# EAGLE schematic GY-SAMD21_HeaderLayout (EAGLE 9.6.2)
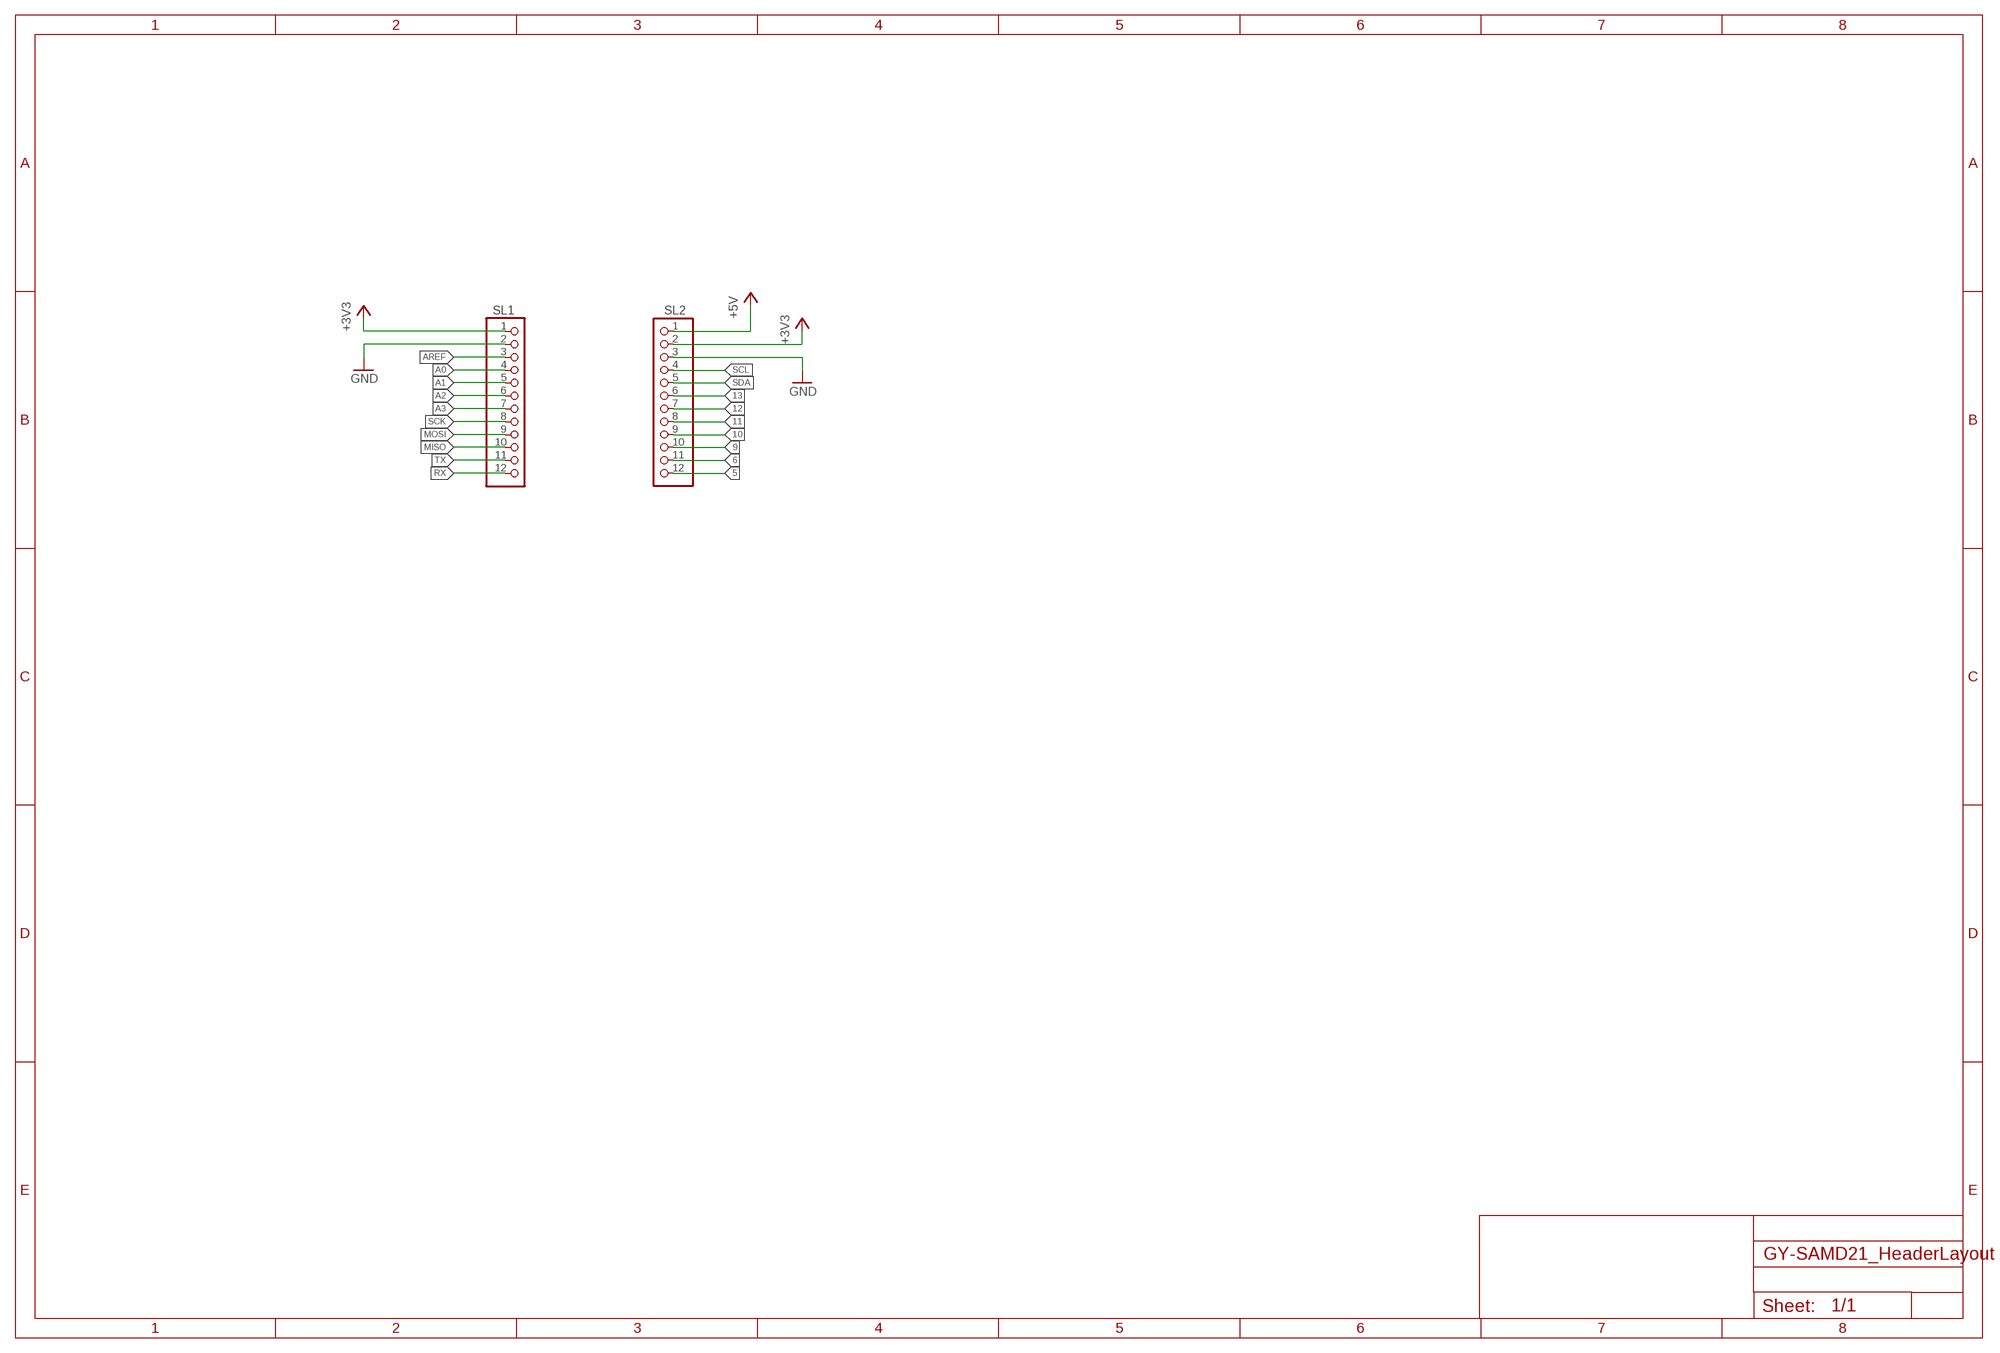
[diagram p0: schematic, sheet 1]

## Parts
SL1  PINHD-1X12  [1X12]
SL2  PINHD-1X12  [1X12]

## Nets
5: SL2.12
6: SL2.11
9: SL2.10
10: SL2.9
11: SL2.8
12: SL2.7
13: SL2.6
+3V3: SL1.1 SL2.2
+5V: SL2.1
A0: SL1.4
A1: SL1.5
A2: SL1.6
A3: SL1.7
AREF: SL1.3
GND: SL1.2 SL2.3
MISO: SL1.10
MOSI: SL1.9
RX: SL1.12
SCK: SL1.8
SCL: SL2.4
SDA: SL2.5
TX: SL1.11

## Library data of the parts
SL1 SL2 = pinhead:PINHD-1X12: PIN HEADER